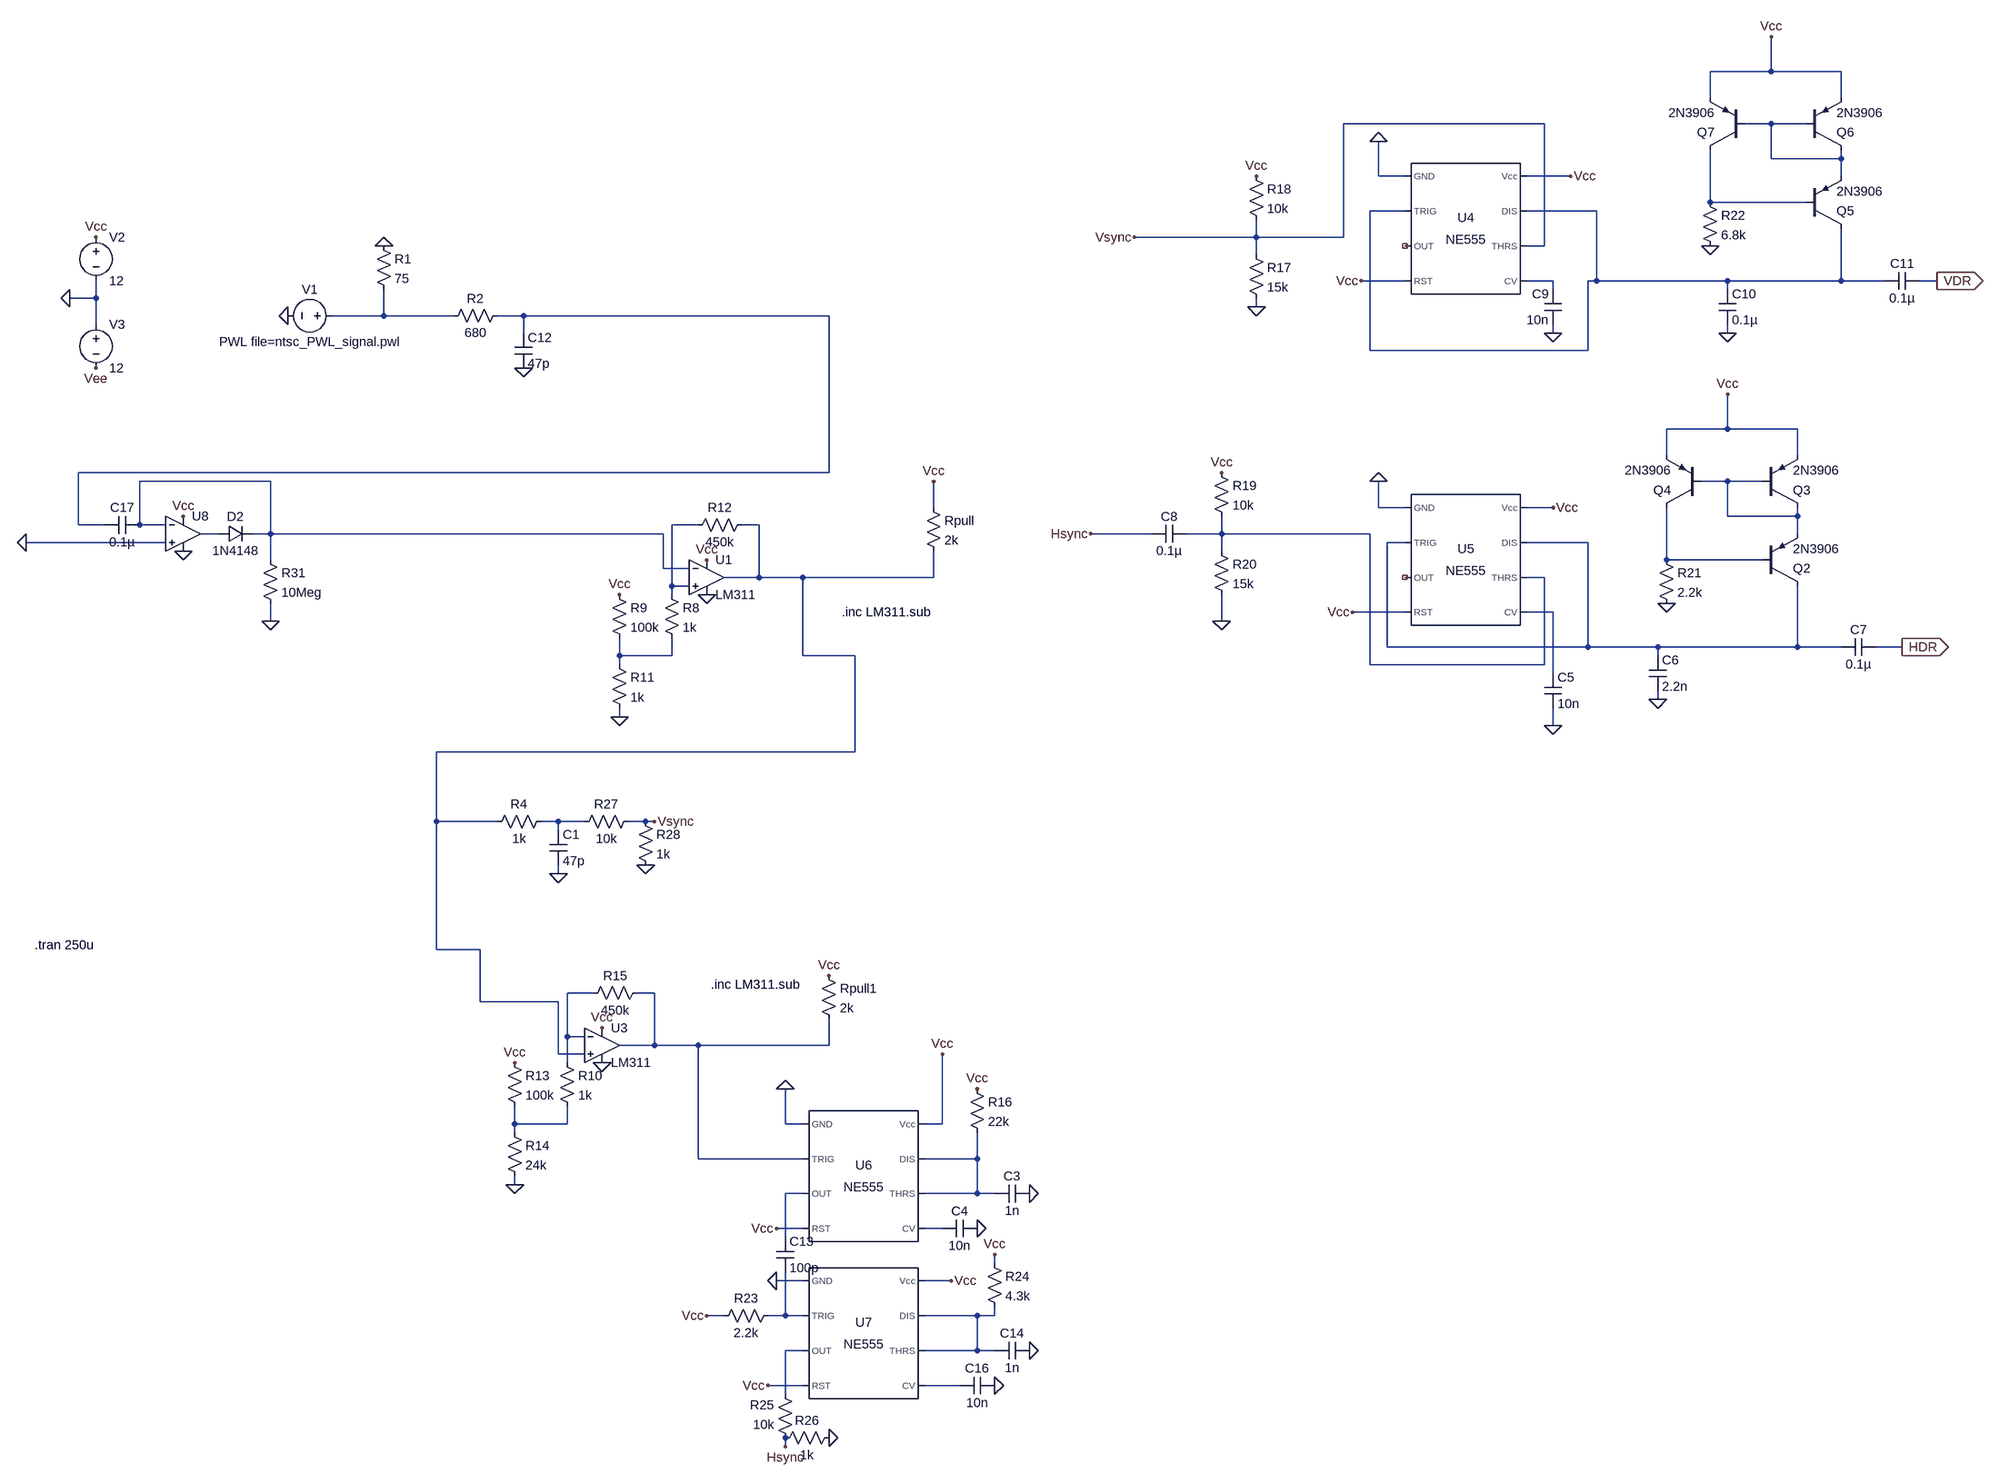
[diagram p0: schematic thirdCircuit.asc]
thirdCircuit.asc, the LTspice schematic file:
Version 4.1
SHEET 1 3116 2052
WIRE 2704 -640 2704 -704
WIRE 2704 -640 2592 -640
WIRE 2832 -640 2704 -640
WIRE 2592 -592 2592 -640
WIRE 2832 -592 2832 -640
WIRE 2288 -544 1920 -544
WIRE 2704 -544 2656 -544
WIRE 2768 -544 2704 -544
WIRE 2704 -480 2704 -544
WIRE 2832 -480 2832 -496
WIRE 2832 -480 2704 -480
WIRE 1984 -448 1984 -512
WIRE 2032 -448 1984 -448
WIRE 2336 -448 2256 -448
WIRE 2832 -448 2832 -480
WIRE 2592 -400 2592 -496
WIRE 2768 -400 2592 -400
WIRE 2032 -384 1968 -384
WIRE 2384 -384 2256 -384
WIRE 1760 -336 1760 -368
WIRE 1760 -336 1536 -336
WIRE 1920 -336 1920 -544
WIRE 1920 -336 1760 -336
WIRE 2288 -320 2288 -544
WIRE 2288 -320 2256 -320
WIRE 1760 -304 1760 -336
WIRE 2032 -256 1952 -256
WIRE 2304 -256 2256 -256
WIRE 2384 -256 2384 -384
WIRE 2384 -256 2368 -256
WIRE 2624 -256 2384 -256
WIRE 2832 -256 2832 -352
WIRE 2832 -256 2624 -256
WIRE 2912 -256 2832 -256
WIRE 3008 -256 2976 -256
WIRE 2304 -240 2304 -256
WIRE 2624 -240 2624 -256
WIRE -368 -224 -368 -256
WIRE -368 -224 -416 -224
WIRE 1760 -208 1760 -224
WIRE 160 -192 160 -240
WIRE 160 -192 64 -192
WIRE 288 -192 160 -192
WIRE 416 -192 368 -192
WIRE 976 -192 416 -192
WIRE -368 -176 -368 -224
WIRE 416 -160 416 -192
WIRE 2304 -160 2304 -176
WIRE 2624 -160 2624 -176
WIRE 1968 -128 1968 -384
WIRE 2368 -128 2368 -256
WIRE 2368 -128 1968 -128
WIRE 2624 16 2624 -48
WIRE 2624 16 2512 16
WIRE 2752 16 2624 16
WIRE 2512 64 2512 16
WIRE 2752 64 2752 16
WIRE 976 96 976 -192
WIRE 976 96 -400 96
WIRE -48 112 -288 112
WIRE 2624 112 2576 112
WIRE 2688 112 2624 112
WIRE 1168 160 1168 112
WIRE 1984 160 1984 112
WIRE 2032 160 1984 160
WIRE 2304 160 2256 160
WIRE 2624 176 2624 112
WIRE 2752 176 2752 160
WIRE 2752 176 2624 176
WIRE -400 192 -400 96
WIRE -352 192 -400 192
WIRE -288 192 -288 112
WIRE -240 192 -288 192
WIRE 736 192 688 192
WIRE 848 192 816 192
WIRE -144 208 -176 208
WIRE -48 208 -48 112
WIRE -48 208 -80 208
WIRE 672 208 -48 208
WIRE 1568 208 1456 208
WIRE 1696 208 1696 176
WIRE 1696 208 1632 208
WIRE 1968 208 1696 208
WIRE 2752 208 2752 176
WIRE -240 224 -496 224
WIRE 2032 224 2000 224
WIRE 2368 224 2256 224
WIRE 1696 240 1696 208
WIRE -48 256 -48 208
WIRE 2512 256 2512 160
WIRE 2688 256 2512 256
WIRE 672 272 672 208
WIRE 720 272 672 272
WIRE 848 288 848 192
WIRE 848 288 784 288
WIRE 928 288 848 288
WIRE 1168 288 1168 240
WIRE 1168 288 928 288
WIRE 2288 288 2256 288
WIRE 688 304 688 192
WIRE 720 304 688 304
WIRE 688 320 688 304
WIRE 2032 352 1936 352
WIRE 2304 352 2256 352
WIRE -48 368 -48 336
WIRE 1696 368 1696 320
WIRE 2000 416 2000 224
WIRE 2368 416 2368 224
WIRE 2368 416 2000 416
WIRE 2496 416 2368 416
WIRE 2752 416 2752 304
WIRE 2752 416 2496 416
WIRE 2832 416 2752 416
WIRE 2944 416 2896 416
WIRE 592 432 592 400
WIRE 688 432 688 400
WIRE 688 432 592 432
WIRE 928 432 928 288
WIRE 1024 432 928 432
WIRE 2496 432 2496 416
WIRE 592 448 592 432
WIRE 1968 448 1968 208
WIRE 2288 448 2288 288
WIRE 2288 448 1968 448
WIRE 2304 464 2304 352
WIRE 2496 512 2496 496
WIRE 592 544 592 528
WIRE 2304 560 2304 528
WIRE 1024 608 1024 432
WIRE 1024 608 256 608
WIRE 256 736 256 608
WIRE 368 736 256 736
WIRE 480 736 448 736
WIRE 528 736 480 736
WIRE 640 736 608 736
WIRE 656 736 640 736
WIRE 480 752 480 736
WIRE 480 832 480 816
WIRE 256 1024 256 736
WIRE 336 1024 256 1024
WIRE 544 1104 496 1104
WIRE 656 1104 624 1104
WIRE 336 1120 336 1024
WIRE 480 1120 336 1120
WIRE 496 1184 496 1104
WIRE 528 1184 496 1184
WIRE 656 1200 656 1104
WIRE 656 1200 592 1200
WIRE 736 1200 656 1200
WIRE 976 1200 976 1152
WIRE 976 1200 736 1200
WIRE 480 1216 480 1120
WIRE 528 1216 480 1216
WIRE 496 1232 496 1184
WIRE 400 1344 400 1312
WIRE 496 1344 496 1312
WIRE 496 1344 400 1344
WIRE 896 1344 896 1280
WIRE 928 1344 896 1344
WIRE 1184 1344 1184 1216
WIRE 1184 1344 1152 1344
WIRE 400 1360 400 1344
WIRE 736 1408 736 1200
WIRE 928 1408 736 1408
WIRE 1248 1408 1248 1360
WIRE 1248 1408 1152 1408
WIRE 400 1456 400 1440
WIRE 928 1472 896 1472
WIRE 1248 1472 1248 1408
WIRE 1248 1472 1152 1472
WIRE 1280 1472 1248 1472
WIRE 928 1536 880 1536
WIRE 1184 1536 1152 1536
WIRE 896 1552 896 1472
WIRE 1280 1600 1280 1584
WIRE 928 1632 880 1632
WIRE 1200 1632 1152 1632
WIRE 784 1696 752 1696
WIRE 896 1696 896 1616
WIRE 896 1696 864 1696
WIRE 928 1696 896 1696
WIRE 1248 1696 1152 1696
WIRE 1280 1696 1280 1680
WIRE 1280 1696 1248 1696
WIRE 928 1760 896 1760
WIRE 1248 1760 1248 1696
WIRE 1248 1760 1152 1760
WIRE 1280 1760 1248 1760
WIRE 928 1824 864 1824
WIRE 1216 1824 1152 1824
WIRE 896 1840 896 1760
WIRE 896 1936 896 1920
FLAG -16 -192 0
FLAG 160 -320 0
FLAG 1760 -208 0
FLAG 1760 -448 Vcc
FLAG 1696 96 Vcc
FLAG 1696 368 0
FLAG 1984 112 0
FLAG 2304 560 0
FLAG 2496 512 0
FLAG 2512 336 0
FLAG 2944 416 HDR
IOPIN 2944 416 Out
FLAG 2336 -448 Vcc
FLAG 1984 -512 0
FLAG 2304 -160 0
FLAG 1952 -256 Vcc
FLAG 2592 -320 0
FLAG 2704 -704 Vcc
FLAG 2624 -160 0
FLAG 3008 -256 VDR
IOPIN 3008 -256 Out
FLAG 1536 -336 Vsync
FLAG 1456 208 Hsync
FLAG 416 -96 0
FLAG 592 544 0
FLAG 752 256 Vcc
FLAG -368 -336 Vcc
FLAG -368 -96 Vee
FLAG -416 -224 0
FLAG 2304 160 Vcc
FLAG 2624 -48 Vcc
FLAG 1936 352 Vcc
FLAG 1168 112 Vcc
FLAG 480 832 0
FLAG 592 320 Vcc
FLAG 752 320 0
FLAG 656 736 Vsync
FLAG 400 1456 0
FLAG 400 1232 Vcc
FLAG 560 1232 0
FLAG 976 1072 Vcc
FLAG 1184 1216 Vcc
FLAG 896 1280 0
FLAG 1344 1472 0
FLAG 1248 1280 Vcc
FLAG 1248 1536 0
FLAG 880 1536 Vcc
FLAG 880 1632 0
FLAG 1280 1584 Vcc
FLAG 752 1696 Vcc
FLAG 864 1824 Vcc
FLAG 1344 1760 0
FLAG 1280 1824 0
FLAG 896 1936 Hsync
FLAG 976 1920 0
FLAG 640 816 0
FLAG 1200 1632 Vcc
FLAG 560 1168 Vcc
FLAG -48 368 0
FLAG -208 176 Vcc
FLAG -496 224 0
FLAG -208 240 0
DATAFLAG 592 432 ""
DATAFLAG 400 1344 ""
SYMBOL voltage 80 -192 R90
WINDOW 0 -32 56 VBottom 2
WINDOW 3 32 56 VTop 2
WINDOW 123 0 0 Left 0
WINDOW 39 0 0 Left 0
SYMATTR InstName V1
SYMATTR Value PWL file=ntsc_PWL_signal.pwl
SYMBOL res 144 -336 R0
SYMATTR InstName R1
SYMATTR Value 75
SYMBOL res 1744 -320 R0
SYMATTR InstName R17
SYMATTR Value 15k
SYMBOL res 1744 -464 R0
SYMATTR InstName R18
SYMATTR Value 10k
SYMBOL Misc\\NE555 2144 -352 R0
SYMATTR InstName U4
SYMBOL Misc\\NE555 2144 256 R0
SYMATTR InstName U5
SYMBOL res 1680 80 R0
SYMATTR InstName R19
SYMATTR Value 10k
SYMBOL res 1680 224 R0
SYMATTR InstName R20
SYMATTR Value 15k
SYMBOL cap 2288 464 R0
SYMATTR InstName C5
SYMATTR Value 10n
SYMBOL cap 2480 432 R0
SYMATTR InstName C6
SYMATTR Value 2.2n
SYMBOL cap 2896 400 R90
WINDOW 0 0 32 VBottom 2
WINDOW 3 32 32 VTop 2
SYMATTR InstName C7
SYMATTR Value 0.1µ
SYMBOL pnp 2688 304 M180
SYMATTR InstName Q2
SYMATTR Value 2N3906
SYMBOL pnp 2688 160 M180
SYMATTR InstName Q3
SYMATTR Value 2N3906
SYMBOL pnp 2576 160 R180
SYMATTR InstName Q4
SYMATTR Value 2N3906
SYMBOL res 2496 240 R0
SYMATTR InstName R21
SYMATTR Value 2.2k
SYMBOL cap 1632 192 R90
WINDOW 0 0 32 VBottom 2
WINDOW 3 32 32 VTop 2
SYMATTR InstName C8
SYMATTR Value 0.1µ
SYMBOL cap 2320 -176 R180
WINDOW 0 24 56 Left 2
WINDOW 3 24 8 Left 2
SYMATTR InstName C9
SYMATTR Value 10n
SYMBOL pnp 2768 -352 M180
SYMATTR InstName Q5
SYMATTR Value 2N3906
SYMBOL pnp 2768 -496 M180
SYMATTR InstName Q6
SYMATTR Value 2N3906
SYMBOL pnp 2656 -496 R180
SYMATTR InstName Q7
SYMATTR Value 2N3906
SYMBOL res 2576 -416 R0
SYMATTR InstName R22
SYMATTR Value 6.8k
SYMBOL cap 2608 -240 R0
SYMATTR InstName C10
SYMATTR Value 0.1µ
SYMBOL cap 2976 -272 R90
WINDOW 0 0 32 VBottom 2
WINDOW 3 32 32 VTop 2
SYMATTR InstName C11
SYMATTR Value 0.1µ
SYMBOL res 384 -208 R90
WINDOW 0 0 56 VBottom 2
WINDOW 3 32 56 VTop 2
SYMATTR InstName R2
SYMATTR Value 680
SYMBOL cap 400 -160 R0
SYMATTR InstName C12
SYMATTR Value 47p
SYMBOL res 672 304 R0
SYMATTR InstName R8
SYMATTR Value 1k
SYMBOL res 576 304 R0
SYMATTR InstName R9
SYMATTR Value 100k
SYMBOL res 576 432 R0
SYMATTR InstName R11
SYMATTR Value 1k
SYMBOL res 832 176 R90
WINDOW 0 0 56 VBottom 2
WINDOW 3 32 56 VTop 2
SYMATTR InstName R12
SYMATTR Value 450k
SYMBOL res 1152 144 R0
SYMATTR InstName Rpull
SYMATTR Value 2k
SYMBOL voltage -368 -352 R0
SYMATTR InstName V2
SYMATTR Value 12
SYMBOL voltage -368 -192 R0
SYMATTR InstName V3
SYMATTR Value 12
SYMBOL res 464 720 R90
WINDOW 0 0 56 VBottom 2
WINDOW 3 32 56 VTop 2
SYMATTR InstName R4
SYMATTR Value 1k
SYMBOL cap 464 752 R0
SYMATTR InstName C1
SYMATTR Value 47p
SYMBOL OpAmps\\opamp2 752 224 R0
SYMATTR InstName U1
SYMATTR Value LM311
SYMBOL res 480 1216 R0
SYMATTR InstName R10
SYMATTR Value 1k
SYMBOL res 384 1216 R0
SYMATTR InstName R13
SYMATTR Value 100k
SYMBOL res 384 1344 R0
SYMATTR InstName R14
SYMATTR Value 24k
SYMBOL res 640 1088 R90
WINDOW 0 0 56 VBottom 2
WINDOW 3 32 56 VTop 2
SYMATTR InstName R15
SYMATTR Value 450k
SYMBOL res 960 1056 R0
SYMATTR InstName Rpull1
SYMATTR Value 2k
SYMBOL OpAmps\\opamp2 560 1136 R0
SYMATTR InstName U3
SYMATTR Value LM311
SYMBOL Misc\\NE555 1040 1440 R0
SYMATTR InstName U6
SYMBOL cap 1344 1456 R90
WINDOW 0 0 32 VBottom 2
WINDOW 3 32 32 VTop 2
SYMATTR InstName C3
SYMATTR Value 1n
SYMBOL res 1232 1264 R0
SYMATTR InstName R16
SYMATTR Value 22k
SYMBOL cap 1248 1520 R90
WINDOW 0 0 32 VBottom 2
WINDOW 3 32 32 VTop 2
SYMATTR InstName C4
SYMATTR Value 10n
SYMBOL Misc\\NE555 1040 1728 R0
SYMATTR InstName U7
SYMBOL cap 880 1552 R0
SYMATTR InstName C13
SYMATTR Value 100p
SYMBOL res 880 1680 R90
WINDOW 0 0 56 VBottom 2
WINDOW 3 32 56 VTop 2
SYMATTR InstName R23
SYMATTR Value 2.2k
SYMBOL res 1264 1584 R0
SYMATTR InstName R24
SYMATTR Value 4.3k
SYMBOL cap 1344 1744 R90
WINDOW 0 0 32 VBottom 2
WINDOW 3 32 32 VTop 2
SYMATTR InstName C14
SYMATTR Value 1n
SYMBOL cap 1280 1808 R90
WINDOW 0 0 32 VBottom 2
WINDOW 3 32 32 VTop 2
SYMATTR InstName C16
SYMATTR Value 10n
SYMBOL res 912 1936 R180
WINDOW 0 36 76 Left 2
WINDOW 3 36 40 Left 2
SYMATTR InstName R25
SYMATTR Value 10k
SYMBOL res 880 1936 R270
WINDOW 0 32 56 VTop 2
WINDOW 3 0 56 VBottom 2
SYMATTR InstName R26
SYMATTR Value 1k
SYMBOL res 624 720 R90
WINDOW 0 0 56 VBottom 2
WINDOW 3 32 56 VTop 2
SYMATTR InstName R27
SYMATTR Value 10k
SYMBOL res 624 720 R0
SYMATTR InstName R28
SYMATTR Value 1k
SYMBOL cap -288 176 R90
WINDOW 0 0 32 VBottom 2
WINDOW 3 32 32 VTop 2
SYMATTR InstName C17
SYMATTR Value 0.1µ
SYMBOL OpAmps\\UniversalOpAmp2 -208 208 R0
SYMATTR InstName U8
SYMBOL diode -144 224 R270
WINDOW 0 32 32 VTop 2
WINDOW 3 0 32 VBottom 2
SYMATTR InstName D2
SYMATTR Value 1N4148
SYMBOL res -64 240 R0
SYMATTR InstName R31
SYMATTR Value 10Meg
TEXT -480 1016 Left 2 !.tran 250u
TEXT 1000 352 Left 2 !.inc LM311.sub
TEXT 760 1088 Left 2 !.inc LM311.sub

The netlist it stands for:
* thirdCircuit.asc
V1 N005 0 PWL file=ntsc_PWL_signal.pwl
R1 0 N005 75
R17 Vsync 0 15k
R18 Vcc Vsync 10k
X§U4 0 N003 NC_01 Vcc N004 Vsync N003 Vcc NE555  ; pins GND TRIG OUT RST CV THRS DIS Vcc
X§U5 0 N013 NC_02 Vcc N015 N012 N013 Vcc NE555  ; pins GND TRIG OUT RST CV THRS DIS Vcc
R19 Vcc N012 10k
R20 N012 0 15k
C5 N015 0 10n
C6 N013 0 2.2n
C7 HDR N013 0.1µ
Q2 N013 N014 N008 0 2N3906
Q3 N008 N008 Vcc 0 2N3906
Q4 N014 N008 Vcc 0 2N3906
R21 N014 0 2.2k
C8 N012 Hsync 0.1µ
C9 0 N004 10n
Q5 N003 N002 N001 0 2N3906
Q6 N001 N001 Vcc 0 2N3906
Q7 N002 N001 Vcc 0 2N3906
R22 N002 0 6.8k
C10 N003 0 0.1µ
C11 VDR N003 0.1µ
R2 N006 N005 680
C12 N006 0 47p
R8 N009 N016 1k
R9 Vcc N016 100k
R11 N016 0 1k
R12 N010 N009 450k
Rpull Vcc N010 2k
V2 Vcc 0 12
V3 0 Vee 12
R4 N017 N010 1k
C1 N017 0 47p
X§U1 N009 N007 Vcc 0 N010 LM311  ; pins In+ In- V+ V- OUT
R10 N018 N020 1k
R13 Vcc N020 100k
R14 N020 0 24k
R15 N019 N018 450k
Rpull1 Vcc N019 2k
X§U3 N010 N018 Vcc 0 N019 LM311  ; pins In+ In- V+ V- OUT
X§U6 0 N019 N022 Vcc N023 N021 N021 Vcc NE555  ; pins GND TRIG OUT RST CV THRS DIS Vcc
C3 0 N021 1n
R16 Vcc N021 22k
C4 0 N023 10n
X§U7 0 N024 N026 Vcc N027 N025 N025 Vcc NE555  ; pins GND TRIG OUT RST CV THRS DIS Vcc
C13 N022 N024 100p
R23 N024 Vcc 2.2k
R24 Vcc N025 4.3k
C14 0 N025 1n
C16 0 N027 10n
R25 Hsync N026 10k
R26 Hsync 0 1k
R27 Vsync N017 10k
R28 Vsync 0 1k
C17 N007 N006 0.1µ
X§U8 0 N007 Vcc 0 N011 level2 Avol=1Meg GBW=10Meg Slew=10Meg Ilimit=25m Rail=0 Vos=0 En=0 Enk=0 In=0 Ink=0 Rin=500Meg  ; pins In+ In- V+ V- OUT
D2 N011 N007 1N4148
R31 N007 0 10Meg
.model D D
.lib standard.dio
.model NPN NPN
.model PNP PNP
.lib standard.bjt
.tran 250u
.inc LM311.sub
.inc LM311.sub
.lib NE555.sub
.lib UniversalOpAmp2.lib
.backanno
.end